# Altium schematic sheet SHDN-BSPD-S01-V00-BSPDBoard.SchDoc: Brake System Plausability Device - BSPD
size A3; DrawnBy: Jonn Dillon; DocumentNumber: 1; Revision: 01; SheetNumber: 1; SheetTotal: 10
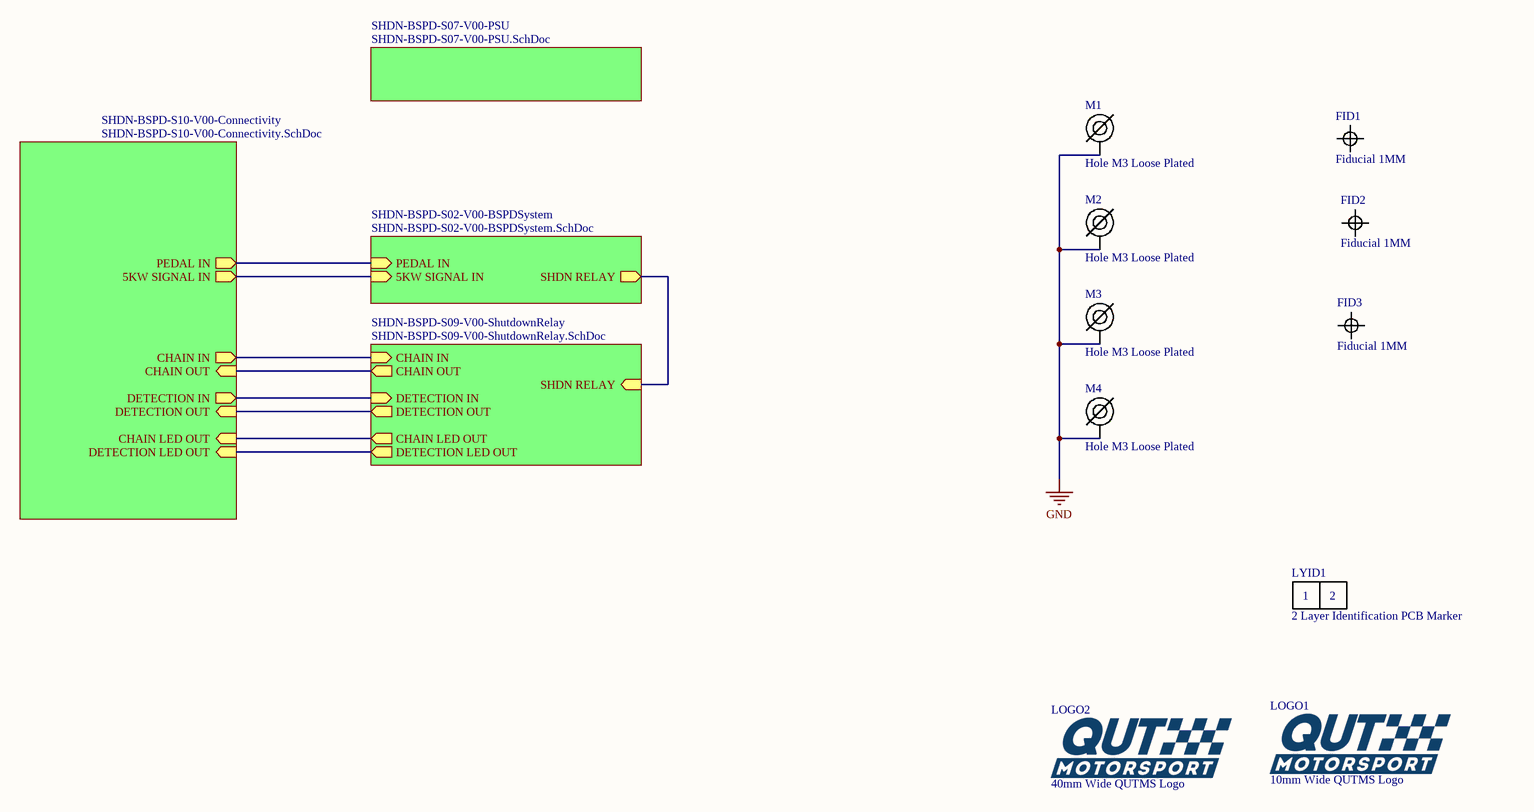
[diagram p0: SHDN-BSPD-S01-V00-BSPDBoard.SchDoc]

## Parts
FID1  Fiducial 1MM  [FIDUCIAL 1MM]
FID2  Fiducial 1MM  [FIDUCIAL 1MM]
FID3  Fiducial 1MM  [FIDUCIAL 1MM]
LOGO1  10mm Wide QUTMS Logo  [QUTMS LOGO 10MM]
LOGO2  40mm Wide QUTMS Logo  [QUTMS LOGO 40MM]
LYID1  2 Layer Identification PCB Marker  [LAYER IDENT 2]
M1  Hole M3 Loose Plated  [M3.5 PLATED]
M2  Hole M3 Loose Plated  [M3.5 PLATED]
M3  Hole M3 Loose Plated  [M3.5 PLATED]
M4  Hole M3 Loose Plated  [M3.5 PLATED]

## Sub-sheets
SHDN-BSPD-S02-V00-BSPDSystem = SHDN-BSPD-S02-V00-BSPDSystem.SchDoc: PEDAL IN (in), 5KW SIGNAL IN (in), SHDN RELAY (out)
SHDN-BSPD-S07-V00-PSU = SHDN-BSPD-S07-V00-PSU.SchDoc: no entries
SHDN-BSPD-S09-V00-ShutdownRelay = SHDN-BSPD-S09-V00-ShutdownRelay.SchDoc: CHAIN OUT (out), CHAIN IN (in), SHDN RELAY (in), DETECTION IN (in), DETECTION OUT (out), CHAIN LED OUT (out), DETECTION LED OUT (out)
SHDN-BSPD-S10-V00-Connectivity = SHDN-BSPD-S10-V00-Connectivity.SchDoc: CHAIN IN (out), CHAIN OUT (in), PEDAL IN (out), 5KW SIGNAL IN (out), DETECTION IN (out), DETECTION OUT (in), CHAIN LED OUT (in), DETECTION LED OUT (in)

## Nets
GND: M1.1 M2.1 M3.1 M4.1
(unnamed): sheet SHDN-BSPD-S10-V00-Connectivity/CHAIN IN, sheet SHDN-BSPD-S09-V00-ShutdownRelay/CHAIN IN
(unnamed): sheet SHDN-BSPD-S10-V00-Connectivity/CHAIN OUT, sheet SHDN-BSPD-S09-V00-ShutdownRelay/CHAIN OUT
(unnamed): sheet SHDN-BSPD-S10-V00-Connectivity/PEDAL IN, sheet SHDN-BSPD-S02-V00-BSPDSystem/PEDAL IN
(unnamed): sheet SHDN-BSPD-S10-V00-Connectivity/5KW SIGNAL IN, sheet SHDN-BSPD-S02-V00-BSPDSystem/5KW SIGNAL IN
(unnamed): sheet SHDN-BSPD-S10-V00-Connectivity/DETECTION IN, sheet SHDN-BSPD-S09-V00-ShutdownRelay/DETECTION IN
(unnamed): sheet SHDN-BSPD-S10-V00-Connectivity/DETECTION OUT, sheet SHDN-BSPD-S09-V00-ShutdownRelay/DETECTION OUT
(unnamed): sheet SHDN-BSPD-S10-V00-Connectivity/CHAIN LED OUT, sheet SHDN-BSPD-S09-V00-ShutdownRelay/CHAIN LED OUT
(unnamed): sheet SHDN-BSPD-S10-V00-Connectivity/DETECTION LED OUT, sheet SHDN-BSPD-S09-V00-ShutdownRelay/DETECTION LED OUT
(unnamed): sheet SHDN-BSPD-S02-V00-BSPDSystem/SHDN RELAY, sheet SHDN-BSPD-S09-V00-ShutdownRelay/SHDN RELAY

## Notes on the sheet
- Revision History:
- Sheet Title:
- Rev
- Date
- Description
- Project:
- Size:
- Drawn By:
- A3
- Number:
- Revision:
- Sheet
- Version:
- of
- QUT Motorsport
- O-120, Gardens Point
- 2 George Street
- Brisbane, QLD 4000
- Australia
- Print Date:
- Print Time:
- File Name:
- (in symbol Layer Identification 2) 1; 2

## Library data of the parts
LOGO1 = QUTMS Logo 10mm
LOGO2 = QUTMS Logo 40mm
LYID1 = Layer Identification 2
M1-M4 = Hole M3 Loose Plated: M3.5 Hole, Plated